# Altium schematic sheet AMSTOMQTT.SchDoc
size 228 x 152 mm
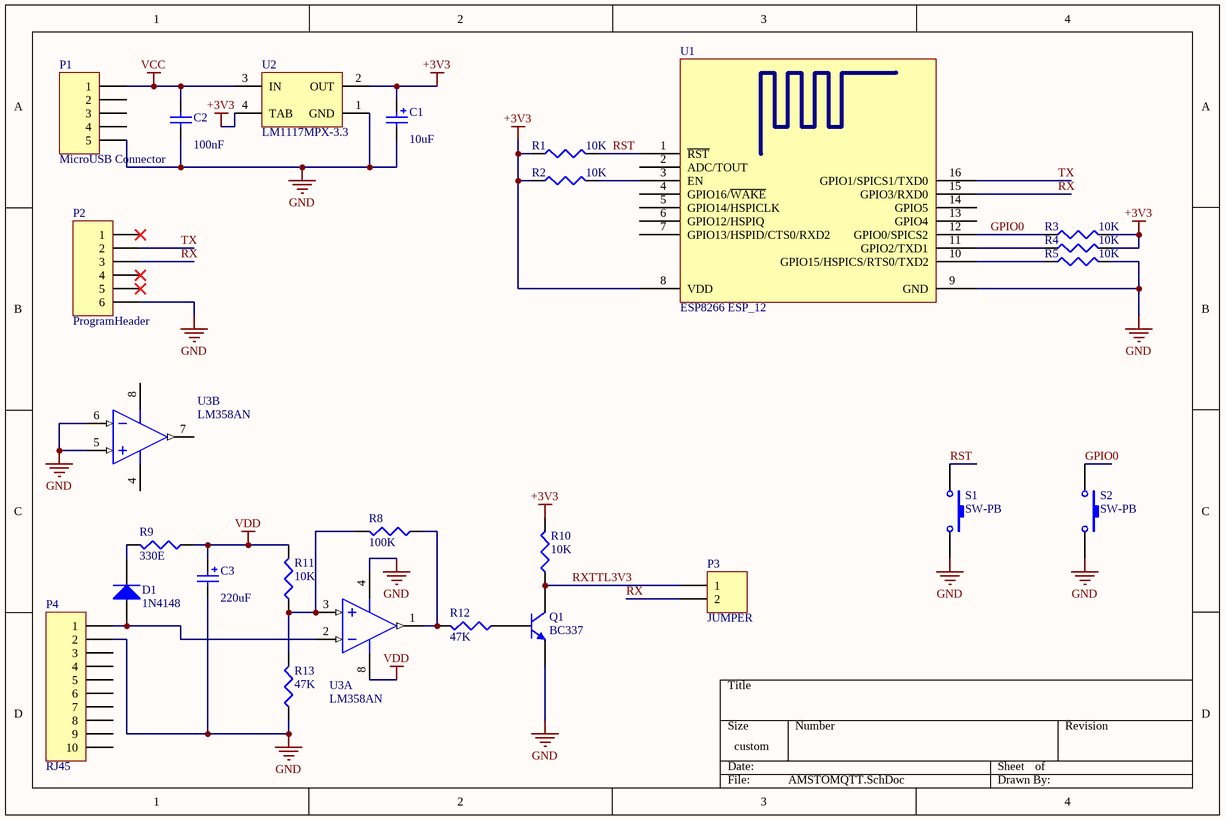
[diagram p0: AMSTOMQTT.SchDoc]

## Parts
C1  value 10uF  [CAP(10uF/25V)]  (hidden comment: Cap Pol2)
C2  value 100nF  [RAD-0.2]  (hidden comment: Cap)
C3  value 220uF  [CAP(10uF/25V)]  (hidden comment: Cap Pol2)
D1  1N4148  [DO-35]
P1  MicroUSB Connector  [MicroUSB]
P2  ProgramHeader  [HDR1X6]
P3  JUMPER  [HDR1X2]
P4  RJ45  [RJ45]
Q1  BC337  [TO-92]
R1  value 10K  [AXIAL-0.3]  (hidden comment: Res3)
R2  value 10K  [AXIAL-0.3]  (hidden comment: Res3)
R3  value 10K  [AXIAL-0.3]  (hidden comment: Res3)
R4  value 10K  [AXIAL-0.3]  (hidden comment: Res3)
R5  value 10K  [AXIAL-0.3]  (hidden comment: Res3)
R8  value 100K  [AXIAL-0.3]  (hidden comment: Res3)
R9  value 330E  [AXIAL-0.3]  (hidden comment: Res3)
R10  value 10K  [AXIAL-0.3]  (hidden comment: Res3)
R11  value 10K  [AXIAL-0.3]  (hidden comment: Res3)
R12  value 47K  [AXIAL-0.3]  (hidden comment: Res3)
R13  value 47K  [AXIAL-0.3]  (hidden comment: Res3)
S1  SW-PB  [PUSHBUTTON]
S2  SW-PB  [PUSHBUTTON]
U1  ESP8266 ESP_12  [ESP8266 ESP_12]
U2  LM1117MPX-3.3  [MP04A_N]
U3  LM358AN  [N08E]  (parts A,B of 2)

## Nets
+3V3: C1.1 R1.1 R2.1 R3.2 R4.2 R10.2 U1.8(VDD) U2.2(OUT) U2.4(TAB)
GND: C1.2 C2.1 C3.2 P1.5 P2.6 P4.2 Q1.1(E) R5.2 R13.1 S1.2 S2.2 U1.9(GND) U2.1(GND) U3.4(GND) U3.5(INB+) U3.6(INB-)
VCC: C2.2 P1.1 U2.3(IN)
VDD: C3.1 R9.1 R11.2 U3.8(V+)
GPIO0: R3.1 S2.1 U1.12(GPIO0/SPICS2)
RST: R1.2 S1.1 U1.1(~{RST})
RX: P2.3 P3.2 U1.15(GPIO3/RXD0)
RXTTL3V3: P3.1 Q1.3(C) R10.1
TX: P2.2 U1.16(GPIO1/SPICS1/TXD0)
NetD1_1: D1.1(A) P4.1 U3.2(INA-)
NetD1_2: D1.2(K) R9.2
NetQ1_2: Q1.2(B) R12.1
NetR2_2: R2.2 U1.3(EN)
NetR4_1: R4.1 U1.11(GPIO2/TXD1)
NetR5_1: R5.1 U1.10(GPIO15/HSPICS/RTS0/TXD2)
NetR8_1: R8.1 R12.2 U3.1(OUTA)
NetR8_2: R8.2 R11.1 R13.2 U3.3(INA+)

Not connected (* = marked no-connect by the designer): P1 2 3 4; P2 1* 4* 5*; P4 3 4 5 6 7 8 9 10; U1 2(ADC/TOUT) 4(GPIO16/~{WAKE}) 5(GPIO14/HSPICLK) 6(GPIO12/HSPIQ) 7(GPIO13/HSPID/CTS0/RXD2) 13(GPIO4) 14(GPIO5); U3 7(OUTB)

## Library data of the parts
C1 C3 = Cap Pol2: Polarized Capacitor (Axial); Published: 8-Jun-2000; LatestRevisionDate: 17-Jul-2002; LatestRevisionNote: Re-released for DXP Platform.; PackageReference: POLAR0.8; Publisher: Altium Limited; PackageDescription: Polarized Capacitor; 2 Leads
C2 = Cap: Capacitor; Published: 8-Jun-2000; LatestRevisionDate: 17-Jul-2002; LatestRevisionNote: Re-released for DXP Platform.; PackageReference: RAD-0.3; Publisher: Altium Limited; PackageDescription: Radial Cap, Thru-Hole; 2 Leads; 0.3 in Pin Spacing
D1 = Diode 1N4148: High Conductance Fast Diode; Published: 8-Jun-2000; LatestRevisionDate: 17-Jul-2002; LatestRevisionNote: Re-released for DXP Platform.; DatasheetVersion: 1997; PackageReference: DO-35; Publisher: Altium Limited; PackageDescription: Diode, Axial; Body 3.8 x 1.9 mm (LxDia. max), Lead Dia. 0.53 mm (max); Code_JEDEC: DO-204-AH; ComponentLink1Description: Manufacturer Link; ComponentLink1URL: http://www.fairchildsemi.com/; ComponentLink2Description: Datasheet; ComponentLink2URL: http://www.fairchildsemi.com/ds/1N%2F1N4148.pdf
P1 = Header 5: Header, 5-Pin; LatestRevisionDate: 17-Jul-2002; LatestRevisionNote: Re-released for DXP Platform.; Publisher: Altium Limited
P2 = Header 6: Header, 6-Pin; LatestRevisionDate: 17-Jul-2002; LatestRevisionNote: Re-released for DXP Platform.; Publisher: Altium Limited
P3 = Header 2: Header, 2-Pin; LatestRevisionDate: 17-Jul-2002; LatestRevisionNote: Re-released for DXP Platform.; Publisher: Altium Limited
P4 = Header 10: Header, 10-Pin; LatestRevisionDate: 17-Jul-2002; LatestRevisionNote: Re-released for DXP Platform.; Publisher: Altium Limited
Q1 = 2N3904: NPN General Purpose Amplifier; Published: 8-Jun-2000; LatestRevisionDate: 15-Jan-2003; LatestRevisionNote: PCB Footprint 'BCY-W3/D4.7' replaced; DatasheetVersion: 1997; PackageVersion: Sep-1998; PackageReference: TO-92A; Publisher: Altium Limited; PackageDescription: TO, Flat Index; 3 In-Line, Axial Leads; Body Dia. 4.5mm; Leads 0.51 x 0.48 mm (max); ComponentLink1Description: Manufacturer Link; ComponentLink1URL: http://www.fairchildsemi.com/; ComponentLink2Description: Datasheet; ComponentLink2URL: http://www.fairchildsemi.com/ds/2N%2F2N3904.pdf
R1-R5 R8-R13 = Res3: Resistor; Published: 8-Jun-2000; LatestRevisionDate: 29-May-2009; LatestRevisionNote: IPC-7351 Footprint Added.; PackageReference: J1-0603; Publisher: Altium Limited; PackageDescription: Chip Resistor
S1 S2 = SW-PB: Switch; Published: 24-Mar-1999; LatestRevisionDate: 17-Jul-2002; LatestRevisionNote: Re-released for DXP Platform.; PackageReference: SPST-2; Publisher: Altium Limited; PackageDescription: Switch; 2 Leads
U1 = ESP8266 ESP_12: ESP8266 ESP-12; IC: ESP8266-EX; Vendor: Ai-thinker; LatestReviewer: Zion Blue; Published: 14-Apr-2015; Publisher: Cynetik Group; LatestRevisionData: 14-Apr-2015; LatestRevisionNote: Include 3D body and Footprint
U2 = LM1117MPX-3.3: 800mA Low-Dropout Linear Regulator, 4-pin SOT-223; Manufacturer: National Semiconductor; PackageTopMarking: XYTT*N05A; PowerWise: N; CompType: LDO IC; High-Reliability: Y; DatasheetVersion: Apr-2006; PackageVersion: revB, Apr-2003; PackageReference: MP04A; PackageDescription: Molded SOT-223, 6.50 x 3.56 x 1.6mm Body, 4 Lead, 2.3mm Pitch; PartNumber: LM1117MPX-3.3; RoHS: N; PinCount: 4; Code_JEDEC: TO-261-AA; Code_IPC: SOT223-4; ComponentLink1Description: Manufacturer URL; ComponentLink1URL: http://www.national.com/; ComponentLink2Description: LM1117 Datasheet; ComponentLink2URL: http://www.national.com/ds/LM/LM1117.pdf; ComponentLink3Description: LM1117 Web Page; ComponentLink3URL: http://www.national.com/pf/LM/LM1117.html; ComponentLink4Description: MP04A Package Page; ComponentLink4URL: http://www.national.com/packaging/folders/mp04a.html
U3 = LM358AN: Low Power Dual Operational Amplifier, 8-pin MDIP; Manufacturer: National Semiconductor; PackageTopMarking: NSUZXYTTE#*LM*358AN; PowerWise: N; CompType: Amplifiers; High-Reliability: Y; DatasheetVersion: Oct-2005; PackageVersion: revG, May-2006; PackageReference: N08E; PackageDescription: MDIP, .365 x .250 x .130in, 8 Lead, .100in Pitch; PartNumber: LM358AN; RoHS: N; PinCount: 8; Code_JEDEC: MS-001-BA; ComponentLink1Description: Manufacturer URL; ComponentLink1URL: http://www.national.com/; ComponentLink2Description: LM358 Datasheet; ComponentLink2URL: http://www.national.com/ds/LM/LM358.pdf; ComponentLink3Description: LM358 Web Page; ComponentLink3URL: http://www.national.com/pf/LM/LM358.html; ComponentLink4Description: N08E Package Page; ComponentLink4URL: http://www.national.com/packaging/folders/n08e.html